# EAGLE schematic numpad (EAGLE 9.6.1)
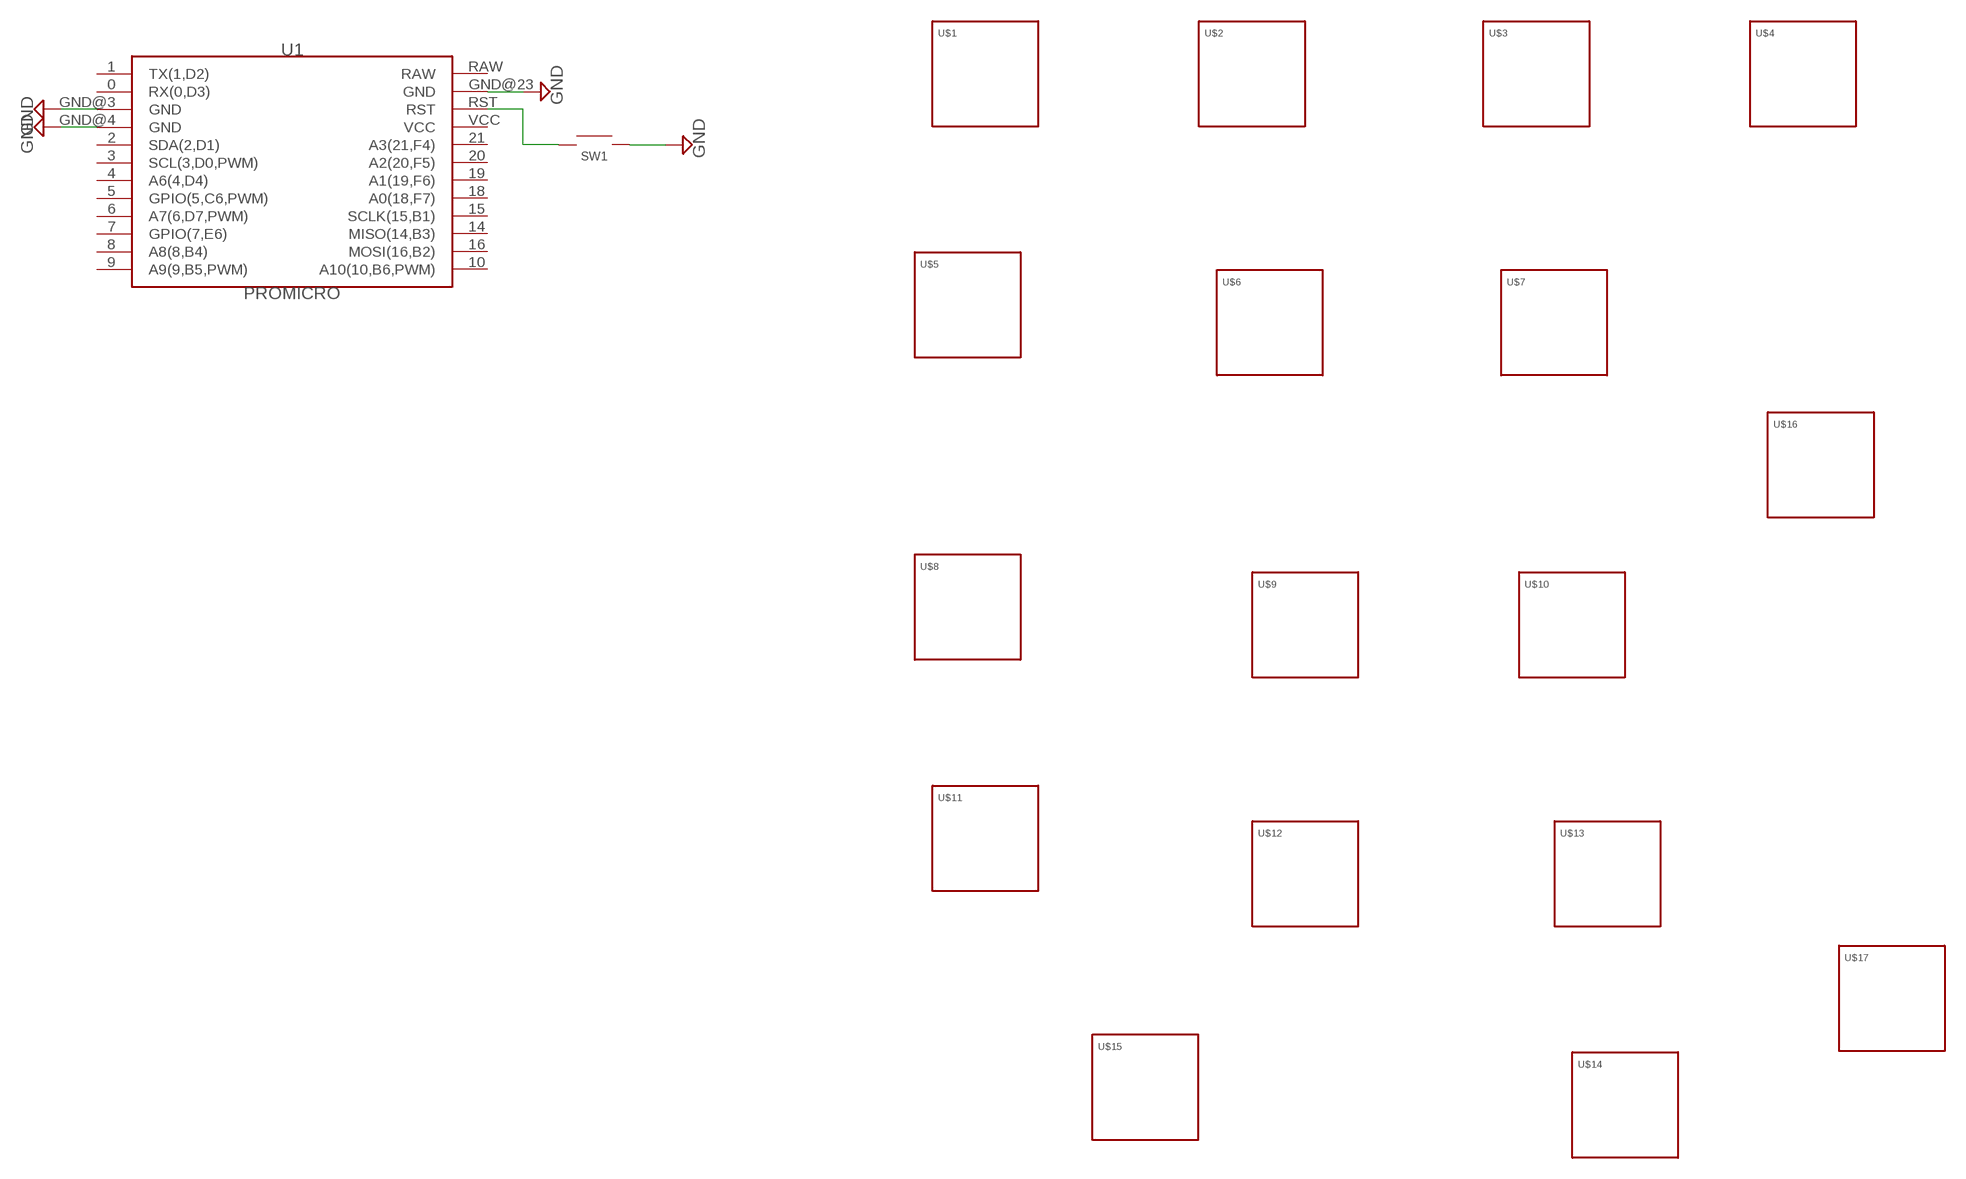
[diagram p0: schematic, sheet 1]

## Parts
SW1  SWITCH-SMD-SCHURTER-1241.1612.11  [SWITCH-SMD-SCHURTER-1241.1612.11]
U1  PROMICRO  [PROMICRO]
U$1  KEYSWITCH-PLATE-MXPLATE-1U  [MXPLATE-1U]
U$2  KEYSWITCH-PLATE-MXPLATE-1U  [MXPLATE-1U]
U$3  KEYSWITCH-PLATE-MXPLATE-1U  [MXPLATE-1U]
U$4  KEYSWITCH-PLATE-MXPLATE-1U  [MXPLATE-1U]
U$5  KEYSWITCH-PLATE-MXPLATE-1U  [MXPLATE-1U]
U$6  KEYSWITCH-PLATE-MXPLATE-1U  [MXPLATE-1U]
U$7  KEYSWITCH-PLATE-MXPLATE-1U  [MXPLATE-1U]
U$8  KEYSWITCH-PLATE-MXPLATE-1U  [MXPLATE-1U]
U$9  KEYSWITCH-PLATE-MXPLATE-1U  [MXPLATE-1U]
U$10  KEYSWITCH-PLATE-MXPLATE-1U  [MXPLATE-1U]
U$11  KEYSWITCH-PLATE-MXPLATE-1U  [MXPLATE-1U]
U$12  KEYSWITCH-PLATE-MXPLATE-1U  [MXPLATE-1U]
U$13  KEYSWITCH-PLATE-MXPLATE-1U  [MXPLATE-1U]
U$14  KEYSWITCH-PLATE-MXPLATE-1U  [MXPLATE-1U]
U$15  KEYSWITCH-PLATE-MXPLATE-2U  [MXPLATE-2U]
U$16  KEYSWITCH-PLATE-MXPLATE-2U-ROTATED  [MXPLATE-2U-ROTATED]
U$17  KEYSWITCH-PLATE-MXPLATE-2U-ROTATED  [MXPLATE-2U-ROTATED]

## Nets
GND: SW1.2A SW1.2B U1.GND@3(GND) U1.GND@4(GND) U1.GND@23(GND)
N$1: SW1.1A SW1.1B U1.RST
Unconnected: U1.0(RX(0,D3)) U1.1(TX(1,D2)) U1.2(SDA(2,D1)) U1.3(SCL(3,D0,PWM)) U1.4(A6(4,D4)) U1.5(GPIO(5,C6,PWM)) U1.6(A7(6,D7,PWM)) U1.7(GPIO(7,E6)) U1.8(A8(8,B4)) U1.9(A9(9,B5,PWM)) U1.10(A10(10,B6,PWM)) U1.14(MISO(14,B3)) U1.15(SCLK(15,B1)) U1.16(MOSI(16,B2)) U1.18(A0(18,F7)) U1.19(A1(19,F6)) U1.20(A2(20,F5)) U1.21(A3(21,F4)) U1.RAW U1.VCC

## Library data of the parts
SW1 = Hardware:SWITCH-SMD
U1 = MCU:PROMICRO
U$1-U$17 = Keyboard:KEYSWITCH-PLATE